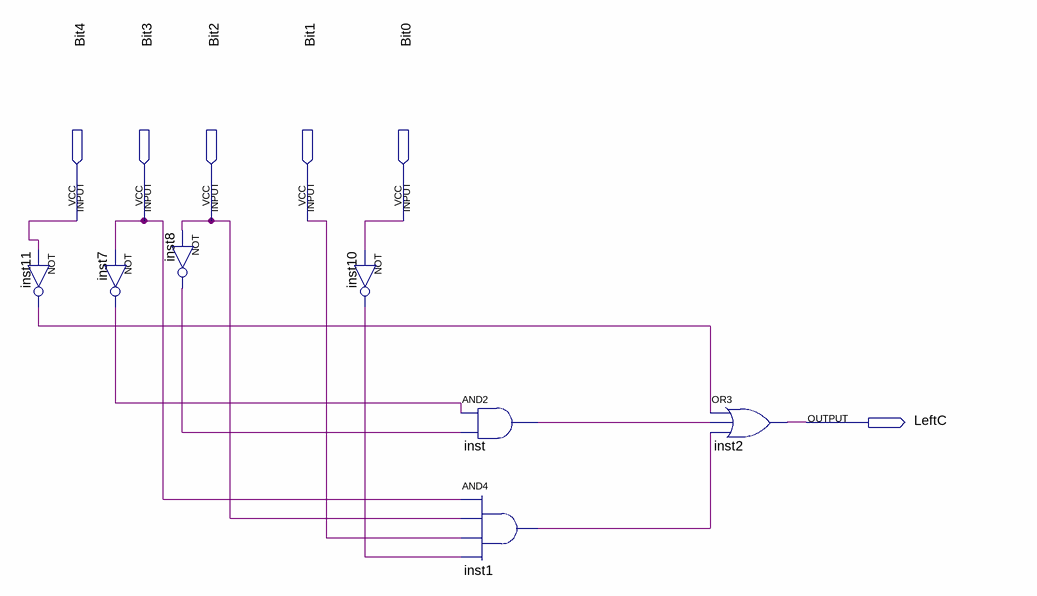
[diagram p0: schematic sheet]
// Quartus schematic LeftC.bdf as structural Verilog: 7 symbols, 6 pins
module LeftC (
  input  Bit4,
  input  Bit3,
  input  Bit2,
  input  Bit1,
  input  Bit0,
  output LeftC
);

  wire inst1_out, inst7_out, inst8_out, inst10_out, inst11_out, inst_out;

  not inst11 (inst11_out, Bit4);
  not inst7 (inst7_out, Bit3);
  not inst8 (inst8_out, Bit2);
  not inst10 (inst10_out, Bit0);
  and inst (inst_out, inst7_out, inst8_out);
  and inst1 (inst1_out, Bit3, Bit2, Bit1, inst10_out);
  or inst2 (LeftC, inst11_out, inst_out, inst1_out);
endmodule
